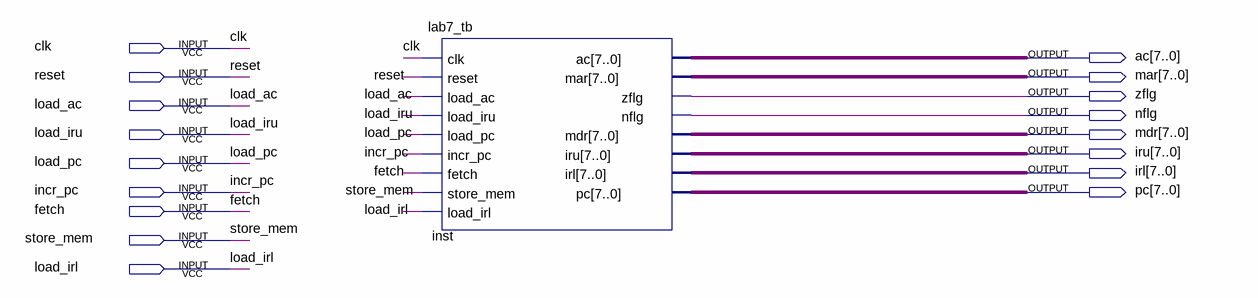
[diagram p0: schematic sheet]
// Quartus schematic lab7_complete_tb.bdf as structural Verilog: 1 symbols, 17 pins
module lab7_complete_tb (
  input  clk,
  input  reset,
  input  load_ac,
  input  load_iru,
  input  load_pc,
  input  incr_pc,
  input  fetch,
  input  store_mem,
  input  load_irl,
  output [7:0] ac,
  output [7:0] mar,
  output zflg,
  output nflg,
  output [7:0] mdr,
  output [7:0] iru,
  output [7:0] irl,
  output [7:0] pc
);

  lab7_tb inst (
    .clk(clk), .reset(reset), .load_ac(load_ac), .load_iru(load_iru), .load_pc(load_pc), .incr_pc(incr_pc),
    .fetch(fetch), .store_mem(store_mem), .load_irl(load_irl), .ac(ac), .mar(mar), .zflg(zflg), .nflg(nflg),
    .mdr(mdr), .iru(iru), .irl(irl), .pc(pc));
endmodule
